# EAGLE schematic PIC32MZ Bare Bones (EAGLE 7.5.0)
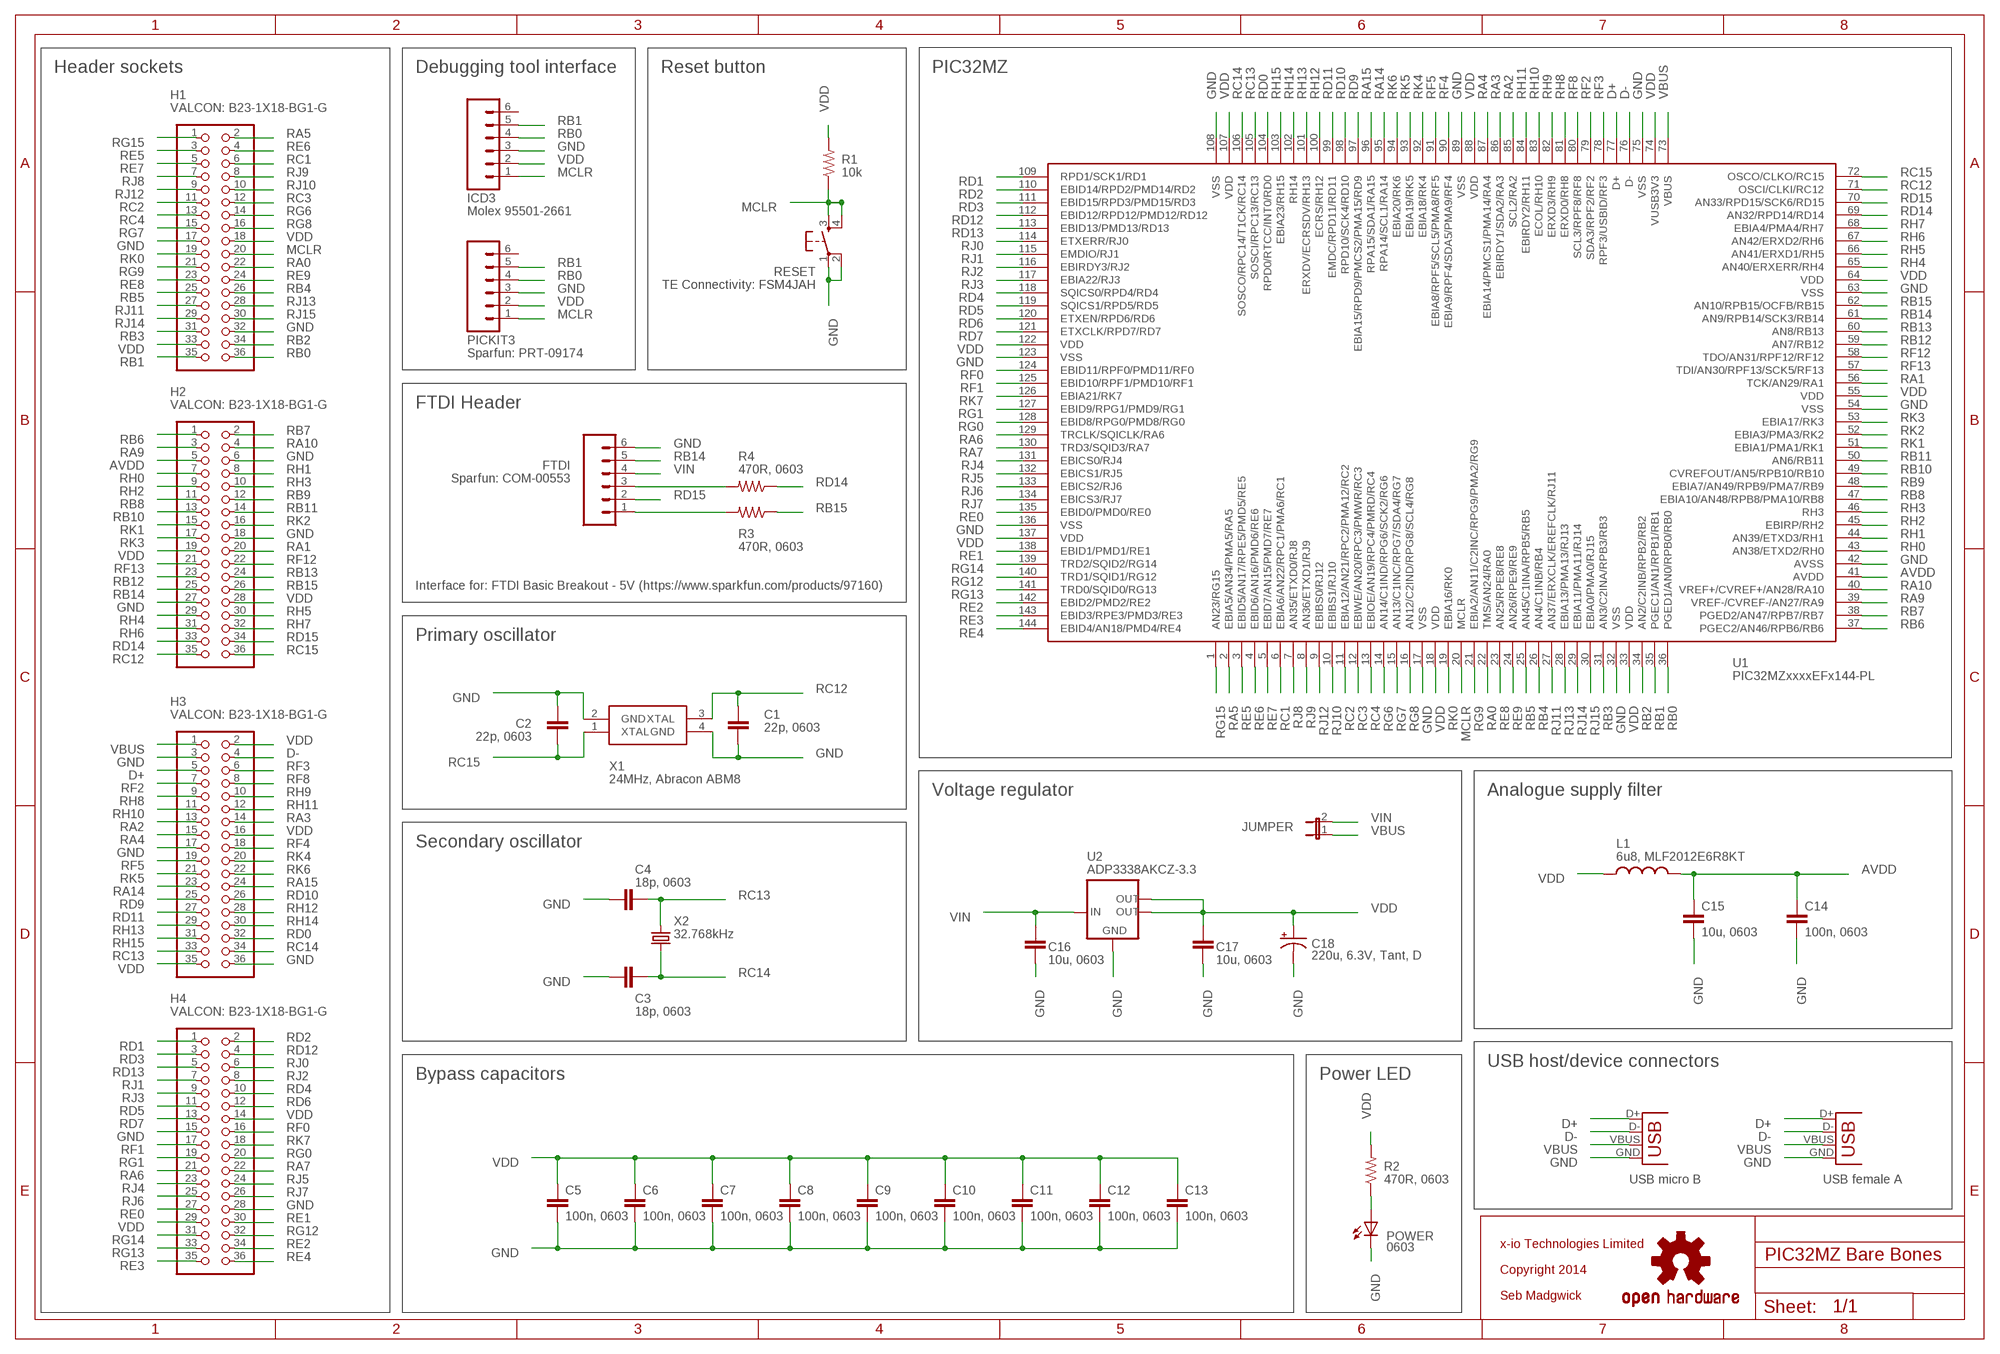
[diagram p0: schematic, sheet 1]

## Parts
C1  22p, 0603  CAP0603-CAP  [0603-CAP]
C2  22p, 0603  CAP0603-CAP  [0603-CAP]
C3  18p, 0603  CAP0603-CAP  [0603-CAP]
C4  18p, 0603  CAP0603-CAP  [0603-CAP]
C5  100n, 0603  CAP0603-CAP  [0603-CAP]
C6  100n, 0603  CAP0603-CAP  [0603-CAP]
C7  100n, 0603  CAP0603-CAP  [0603-CAP]
C8  100n, 0603  CAP0603-CAP  [0603-CAP]
C9  100n, 0603  CAP0603-CAP  [0603-CAP]
C10  100n, 0603  CAP0603-CAP  [0603-CAP]
C11  100n, 0603  CAP0603-CAP  [0603-CAP]
C12  100n, 0603  CAP0603-CAP  [0603-CAP]
C13  100n, 0603  CAP0603-CAP  [0603-CAP]
C14  100n, 0603  CAP0603-CAP  [0603-CAP]
C15  10u, 0603  CAP0603-CAP  [0603-CAP]
C16  10u, 0603  CAP0603-CAP  [0603-CAP]
C17  10u, 0603  CAP0603-CAP  [0603-CAP]
C18  220u, 6.3V, Tant, D  CPOL-USSMCD  [SMC_D]
FTDI  Sparfun: COM-00553  M06SIP  [1X06]
H1  VALCON: B23-1X18-BG1-G  PINHD-2X18  [2X18]
H2  VALCON: B23-1X18-BG1-G  PINHD-2X18  [2X18]
H3  VALCON: B23-1X18-BG1-G  PINHD-2X18  [2X18]
H4  VALCON: B23-1X18-BG1-G  PINHD-2X18  [2X18]
ICD3  Molex 95501-2661  RJ11-6PTH  [RJ11-6]
JUMPER  JUMPER-2SMD-NO  [SJ_2S-NO]
L1  6u8, MLF2012E6R8KT  INDUCTOR1007  [1007]
PICKIT3  Sparfun: PRT-09174  M06SIP  [1X06]
POWER  0603  LED0603  [LED-0603]
R1  10k  RESISTOR0603-RES  [0603-RES]
R2  470R, 0603  RESISTOR0603-RES  [0603-RES]
R3  470R, 0603  RESISTOR0603-RES  [0603-RES]
R4  470R, 0603  RESISTOR0603-RES  [0603-RES]
RESET  TE Connectivity: FSM4JAH  TAC_SWITCHPTH  [TACTILE-PTH]
U1  PIC32MZxxxxEFx144-PL  PIC32MZ2048EC(G/H/M)144-PL  [LQFP144]
U2  ADP3338AKCZ-3.3  ADP3338  [SOT223]
U$4  OSHW-LOGOS  [OSHW-LOGO-S]
X1  24MHz, Abracon ABM8  ABM8  [ABM8]
X2  32.768kHz  CRYSTALTC26H  [TC26H]
X3  USB-MICROB  [USB-MICROB]
X4  USB-A-SMD  [USB-A-S-NOSILK-FEMALE]

## Nets
AVDD: C14.1 C15.1 H2.5 L1.2 U1.41(AVDD)
D+: H3.5 U1.77(D+) X3.D+ X4.D+
D-: H3.4 U1.76(D-) X3.D- X4.D-
GND: C1.2 C2.1 C3.2 C4.2 C5.2 C6.2 C7.2 C8.2 C9.2 C10.2 C11.2 C12.2 C13.2 C14.2 C15.2 C16.2 C17.2 C18.- FTDI.6 H1.17 H1.32 H2.6 H2.18 H2.27 H3.3 H3.17 H3.36 H4.15 H4.28 ICD3.3 PICKIT3.3 POWER.C RESET.1 RESET.2 U1.17(VSS) U1.32(VSS) U1.42(AVSS) U1.54(VSS) U1.63(VSS) U1.75(VSS) U1.89(VSS) U1.108(VSS) U1.123(VSS) U1.136(VSS) U2.1(GND) X1.2(GND) X1.4(GND) X3.GND X4.GND
MCLR: H1.20 ICD3.1 PICKIT3.1 R1.1 RESET.3 RESET.4 U1.20(MCLR)
N$1: FTDI.3 R4.2
N$2: FTDI.1 R3.2
N$4: POWER.A R2.1
RA0: H1.22 U1.22(TMS/AN24/RA0)
RA1: H2.20 U1.56(TCK/AN29/RA1)
RA2: H3.13 U1.85(SCL2/RA2)
RA3: H3.14 U1.86(EBIRDY1/SDA2/RA3)
RA4: H3.15 U1.87(EBIA14/PMCS1/PMA14/RA4)
RA5: H1.2 U1.2(EBIA5/AN34/PMA5/RA5)
RA6: H4.21 U1.129(TRCLK/SQICLK/RA6)
RA7: H4.22 U1.130(TRD3/SQID3/RA7)
RA9: H2.3 U1.39(VREF-/CVREF-/AN27/RA9)
RA10: H2.4 U1.40(VREF+/CVREF+/AN28/RA10)
RA14: H3.23 U1.95(RPA14/SCL1/RA14)
RA15: H3.24 U1.96(RPA15/SDA1/RA15)
RB0: H1.36 ICD3.4 PICKIT3.4 U1.36(PGED1/AN0/RPB0/RB0)
RB1: H1.35 ICD3.5 PICKIT3.5 U1.35(PGEC1/AN1/RPB1/RB1)
RB2: H1.34 U1.34(AN2/C2INB/RPB2/RB2)
RB3: H1.31 U1.31(AN3/C2INA/RPB3/RB3)
RB4: H1.26 U1.26(AN4/C1INB/RB4)
RB5: H1.25 U1.25(AN45/C1INA/RPB5/RB5)
RB6: H2.1 U1.37(PGEC2/AN46/RPB6/RB6)
RB7: H2.2 U1.38(PGED2/AN47/RPB7/RB7)
RB8: H2.11 U1.47(EBIA10/AN48/RPB8/PMA10/RB8)
RB9: H2.12 U1.48(EBIA7/AN49/RPB9/PMA7/RB9)
RB10: H2.13 U1.49(CVREFOUT/AN5/RPB10/RB10)
RB11: H2.14 U1.50(AN6/RB11)
RB12: H2.23 U1.59(AN7/RB12)
RB13: H2.24 U1.60(AN8/RB13)
RB14: FTDI.5 H2.25 U1.61(AN9/RPB14/SCK3/RB14)
RB15: H2.26 R3.1 U1.62(AN10/RPB15/OCFB/RB15)
RC1: H1.6 U1.6(EBIA6/AN22/RPC1/PMA6/RC1)
RC2: H1.11 U1.11(EBIA12/AN21/RPC2/PMA12/RC2)
RC3: H1.12 U1.12(EBIWE/AN20/RPC3/PMWR/RC3)
RC4: H1.13 U1.13(EBIOE/AN19/RPC4/PMRD/RC4)
RC12: C1.1 H2.35 U1.71(OSCI/CLKI/RC12) X1.3(XTAL)
RC13: C4.1 H3.33 U1.105(SOSCI/RPC13/RC13) X2.1
RC14: C3.1 H3.34 U1.106(SOSCO/RPC14/T1CK/RC14) X2.2
RC15: C2.2 H2.36 U1.72(OSCO/CLKO/RC15) X1.1(XTAL)
RD0: H3.32 U1.104(RPD0/RTCC/INT0/RD0)
RD1: H4.1 U1.109(RPD1/SCK1/RD1)
RD2: H4.2 U1.110(EBID14/RPD2/PMD14/RD2)
RD3: H4.3 U1.111(EBID15/RPD3/PMD15/RD3)
RD4: H4.10 U1.118(SQICS0/RPD4/RD4)
RD5: H4.11 U1.119(SQICS1/RPD5/RD5)
RD6: H4.12 U1.120(ETXEN/RPD6/RD6)
RD7: H4.13 U1.121(ETXCLK/RPD7/RD7)
RD9: H3.25 U1.97(EBIA15/RPD9/PMCS2/PMA15/RD9)
RD10: H3.26 U1.98(RPD10/SCK4/RD10)
RD11: H3.27 U1.99(EMDC/RPD11/RD11)
RD12: H4.4 U1.112(EBID12/RPD12/PMD12/RD12)
RD13: H4.5 U1.113(EBID13/PMD13/RD13)
RD14: H2.33 R4.1 U1.69(AN32/RPD14/RD14)
RD15: FTDI.2 H2.34 U1.70(AN33/RPD15/SCK6/RD15)
RE0: H4.27 U1.135(EBID0/PMD0/RE0)
RE1: H4.30 U1.138(EBID1/PMD1/RE1)
RE2: H4.34 U1.142(EBID2/PMD2/RE2)
RE3: H4.35 U1.143(EBID3/RPE3/PMD3/RE3)
RE4: H4.36 U1.144(EBID4/AN18/PMD4/RE4)
RE5: H1.3 U1.3(EBID5/AN17/RPE5/PMD5/RE5)
RE6: H1.4 U1.4(EBID6/AN16/PMD6/RE6)
RE7: H1.5 U1.5(EBID7/AN15/PMD7/RE7)
RE8: H1.23 U1.23(AN25/RPE8/RE8)
RE9: H1.24 U1.24(AN26/RPE9/RE9)
RF0: H4.16 U1.124(EBID11/RPF0/PMD11/RF0)
RF1: H4.17 U1.125(EBID10/RPF1/PMD10/RF1)
RF2: H3.7 U1.79(SDA3/RPF2/RF2)
RF3: H3.6 U1.78(RPF3/USBID/RF3)
RF4: H3.18 U1.90(EBIA9/RPF4/SDA5/PMA9/RF4)
RF5: H3.19 U1.91(EBIA8/RPF5/SCL5/PMA8/RF5)
RF8: H3.8 U1.80(SCL3/RPF8/RF8)
RF12: H2.22 U1.58(TDO/AN31/RPF12/RF12)
RF13: H2.21 U1.57(TDI/AN30/RPF13/SCK5/RF13)
RG0: H4.20 U1.128(EBID8/RPG0/PMD8/RG0)
RG1: H4.19 U1.127(EBID9/RPG1/PMD9/RG1)
RG6: H1.14 U1.14(AN14/C1IND/RPG6/SCK2/RG6)
RG7: H1.15 U1.15(AN13/C1INC/RPG7/SDA4/RG7)
RG8: H1.16 U1.16(AN12/C2IND/RPG8/SCL4/RG8)
RG9: H1.21 U1.21(EBIA2/AN11/C2INC/RPG9/PMA2/RG9)
RG12: H4.32 U1.140(TRD1/SQID1/RG12)
RG13: H4.33 U1.141(TRD0/SQID0/RG13)
RG14: H4.31 U1.139(TRD2/SQID2/RG14)
RG15: H1.1 U1.1(AN23/RG15)
RH0: H2.7 U1.43(AN38/ETXD2/RH0)
RH1: H2.8 U1.44(AN39/ETXD3/RH1)
RH2: H2.9 U1.45(EBIRP/RH2)
RH3: H2.10 U1.46(RH3)
RH4: H2.29 U1.65(AN40/ERXERR/RH4)
RH5: H2.30 U1.66(AN41/ERXD1/RH5)
RH6: H2.31 U1.67(AN42/ERXD2/RH6)
RH7: H2.32 U1.68(EBIA4/PMA4/RH7)
RH8: H3.9 U1.81(ERXD0/RH8)
RH9: H3.10 U1.82(ERXD3/RH9)
RH10: H3.11 U1.83(ECOL/RH10)
RH11: H3.12 U1.84(EBIRDY2/RH11)
RH12: H3.28 U1.100(ECRS/RH12)
RH13: H3.29 U1.101(ERXDV/ECRSDV/RH13)
RH14: H3.30 U1.102(RH14)
RH15: H3.31 U1.103(EBIA23/RH15)
RJ0: H4.6 U1.114(ETXERR/RJ0)
RJ1: H4.7 U1.115(EMDIO/RJ1)
RJ2: H4.8 U1.116(EBIRDY3/RJ2)
RJ3: H4.9 U1.117(EBIA22/RJ3)
RJ4: H4.23 U1.131(EBICS0/RJ4)
RJ5: H4.24 U1.132(EBICS1/RJ5)
RJ6: H4.25 U1.133(EBICS2/RJ6)
RJ7: H4.26 U1.134(EBICS3/RJ7)
RJ8: H1.7 U1.7(AN35/ETXD0/RJ8)
RJ9: H1.8 U1.8(AN36/ETXD1/RJ9)
RJ10: H1.10 U1.10(EBIBS1/RJ10)
RJ11: H1.27 U1.27(AN37/ERXCLK/EREFCLK/RJ11)
RJ12: H1.9 U1.9(EBIBS0/RJ12)
RJ13: H1.28 U1.28(EBIA13/PMA13/RJ13)
RJ14: H1.29 U1.29(EBIA11/PMA11/RJ14)
RJ15: H1.30 U1.30(EBIA0/PMA0/RJ15)
RK0: H1.19 U1.19(EBIA16/RK0)
RK1: H2.15 U1.51(EBIA1/PMA1/RK1)
RK2: H2.16 U1.52(EBIA3/PMA3/RK2)
RK3: H2.17 U1.53(EBIA17/RK3)
RK4: H3.20 U1.92(EBIA18/RK4)
RK5: H3.21 U1.93(EBIA19/RK5)
RK6: H3.22 U1.94(EBIA20/RK6)
RK7: H4.18 U1.126(EBIA21/RK7)
VBUS: H3.1 JUMPER.1 U1.73(VBUS) X3.VBUS X4.VBUS
VDD: C5.1 C6.1 C7.1 C8.1 C9.1 C10.1 C11.1 C12.1 C13.1 C17.1 C18.+ H1.18 H1.33 H2.19 H2.28 H3.2 H3.16 H3.35 H4.14 H4.29 ICD3.2 L1.1 PICKIT3.2 R1.2 R2.2 U1.18(VDD) U1.33(VDD) U1.55(VDD) U1.64(VDD) U1.74(VUSB3V3) U1.88(VDD) U1.107(VDD) U1.122(VDD) U1.137(VDD) U2.2(OUT) U2.4(OUT)
VIN: C16.1 FTDI.4 JUMPER.2 U2.3(IN)
Unconnected: ICD3.6 PICKIT3.6

## Notes on the sheet
- Header sockets | Debugging tool interface | Reset button | PIC32MZ
- FTDI Header
- Interface for: FTDI Basic Breakout - 5V (https://www.sparkfun.com/products/97160)
- Primary oscillator
- Voltage regulator | Analogue supply filter
- Secondary oscillator
- USB host/device connectors
- Bypass capacitors | Power LED
- USB micro B | USB female A
- x-io Technologies Limited
- Copyright 2014
- Seb Madgwick

## Library data of the parts
C1-C17 = SparkFun:CAP: Capacitor Standard 0603 ceramic capacitor, and 0.1" leaded capacitor.
C18 = rcl:CPOL-US: POLARIZED CAPACITOR, American symbol
FTDI PICKIT3 = SparkFun:M06: Header 6 Standard 6-pin 0.1" header. Use with straight break away headers (SKU : PRT-00116), right angle break away headers (PRT-00553), swiss pins (PRT-00743), machine pins (PRT-00117), and female headers (PRT-00115). Molex polarized connector foot print use with SKU : PRT-08094 with associated crimp pins and housings. NOTES ON THE VARIANTS LOCK and LOCK_LONGPADS... This footprint was designed to help hold the alignment of a through-hole component (i.e. 6-pin header) while soldering it into place. You may notice that each hole has been shifted either up or down by 0.005 of an inch from it's more standard position (which is a perfectly straight line). This slight alteration caused the pins (the squares in the middle) to touch the edges of the holes. Because they are alternating, it causes a "brace" to hold the component in place. 0.005 has proven to be the perfect amount of "off-center" position when using our standard breakaway headers. Although looks a little odd when you look at the bare footprint, once you have a header in there, the alteration is very hard to notice. Also, if you push a header all the way into place, it is covered up entirely on the bottom side. This idea of altering the position of holes to aid alignment will be further integrated into the Sparkfun Library for other footprints. It can help hold any component with 3 or more connection pins.
H1-H4 = pinhead:PINHD-2X18: PIN HEADER
ICD3 = SparkFun:RJ11-6: RJ11 Jack Simple 6 pin RJ11 jack. Commonly found on CAT3 devices and Microchip programmers. SKU: PRT-00132
JUMPER = SparkFun:JUMPER-2: Jumper Basic 0.1" spaced jumper. Use with breakaway headers.
L1 = SparkFun:INDUCTOR: Inductors Basic Inductor/Choke - 0603 and 1206. Footprints are not proven and vary greatly between part numbers.
POWER = SparkFun:LED: LEDs Standard schematic elements and footprints for 5mm, 3mm, 1206, and 0603 sized LEDs. 5mm - Spark Fun Electronics SKU : COM-00529 (and others)
R1-R4 = SparkFun:RESISTOR: Resistor Basic schematic elements and footprints for 0603, 1206, and PTH 1/10th watt (small) resistors.
RESET = SparkFun:TAC_SWITCH: Momentary Switch Button commonly used for reset or general input. Spark Fun Electronics SKU : COM-00097
U1 = x-io:PIC32MZ2048EC(G/H/M)144
U2 = x-io:ADP3338: Voltage Regulator Standard LM317 adjustable voltage regulator. AOI (Adjust Output Input). Google 'LM317 Calculator' for easy to use app to get the two resistor values needed. 240/720 for 5V output. 240/390 for 3.3V output. Spark Fun Electronics SKU : COM-00527
U$4 = SparkFun_08_2011:OSHW-LOGO: Open Source Hardware Logo This logo indicates the piece of hardware it is found on incorporates a OSHW license and/or adheres to the definition of open source hardware found here: http://freedomdefined.org/OSHW
X1 = x-io:ABM8
X2 = crystal:CRYSTAL: CRYSTAL
X3 X4 = SparkFun:USB: USB Connectors USB-B-PTH is fully proven SKU : PRT-00139 USB-miniB is fully proven SKU : PRT-00587 USB-A-PCB is untested. USB-A-H is throughly reviewed, but untested. Spark Fun Electronics SKU : PRT-00437 USB-B-SMT is throughly reviewed, but untested. Needs silkscreen touching up. USB-A-S has not been used/tested USB-MB-H has not been used/tested